# Altium project PROC101D_SCH_With_Design_Updates..Notes_V1.0.PrjPcb (part 8 of 23)

## Sheet 20.SchDoc
size 513 x 386 mm
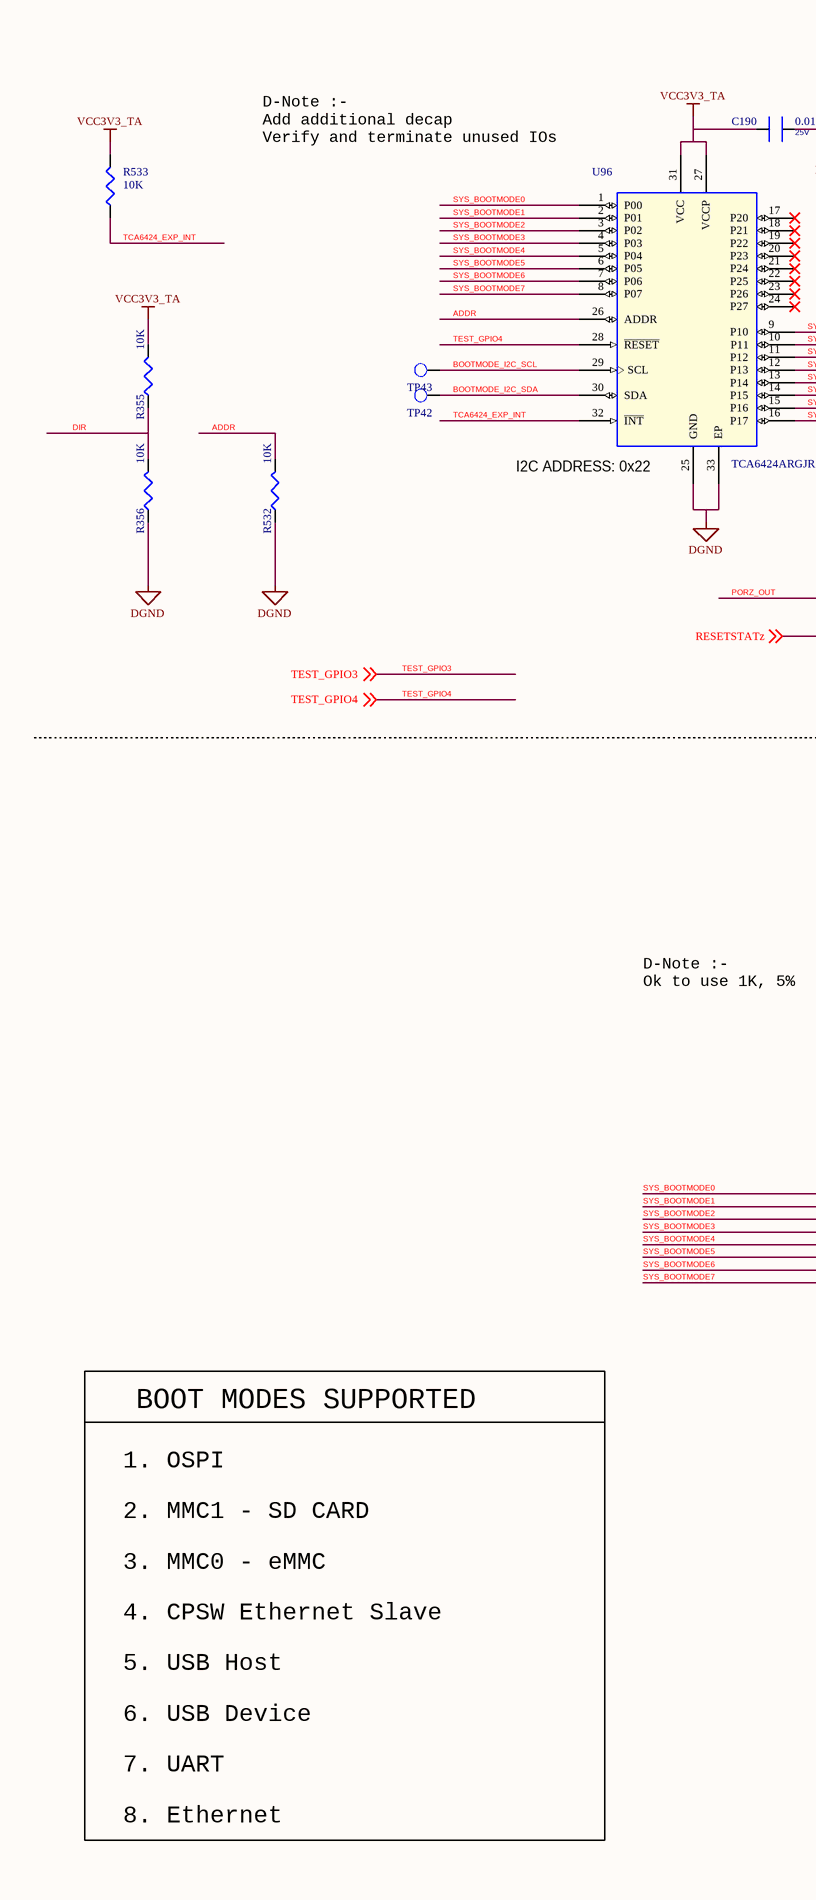
[diagram p30: 20.SchDoc, left]
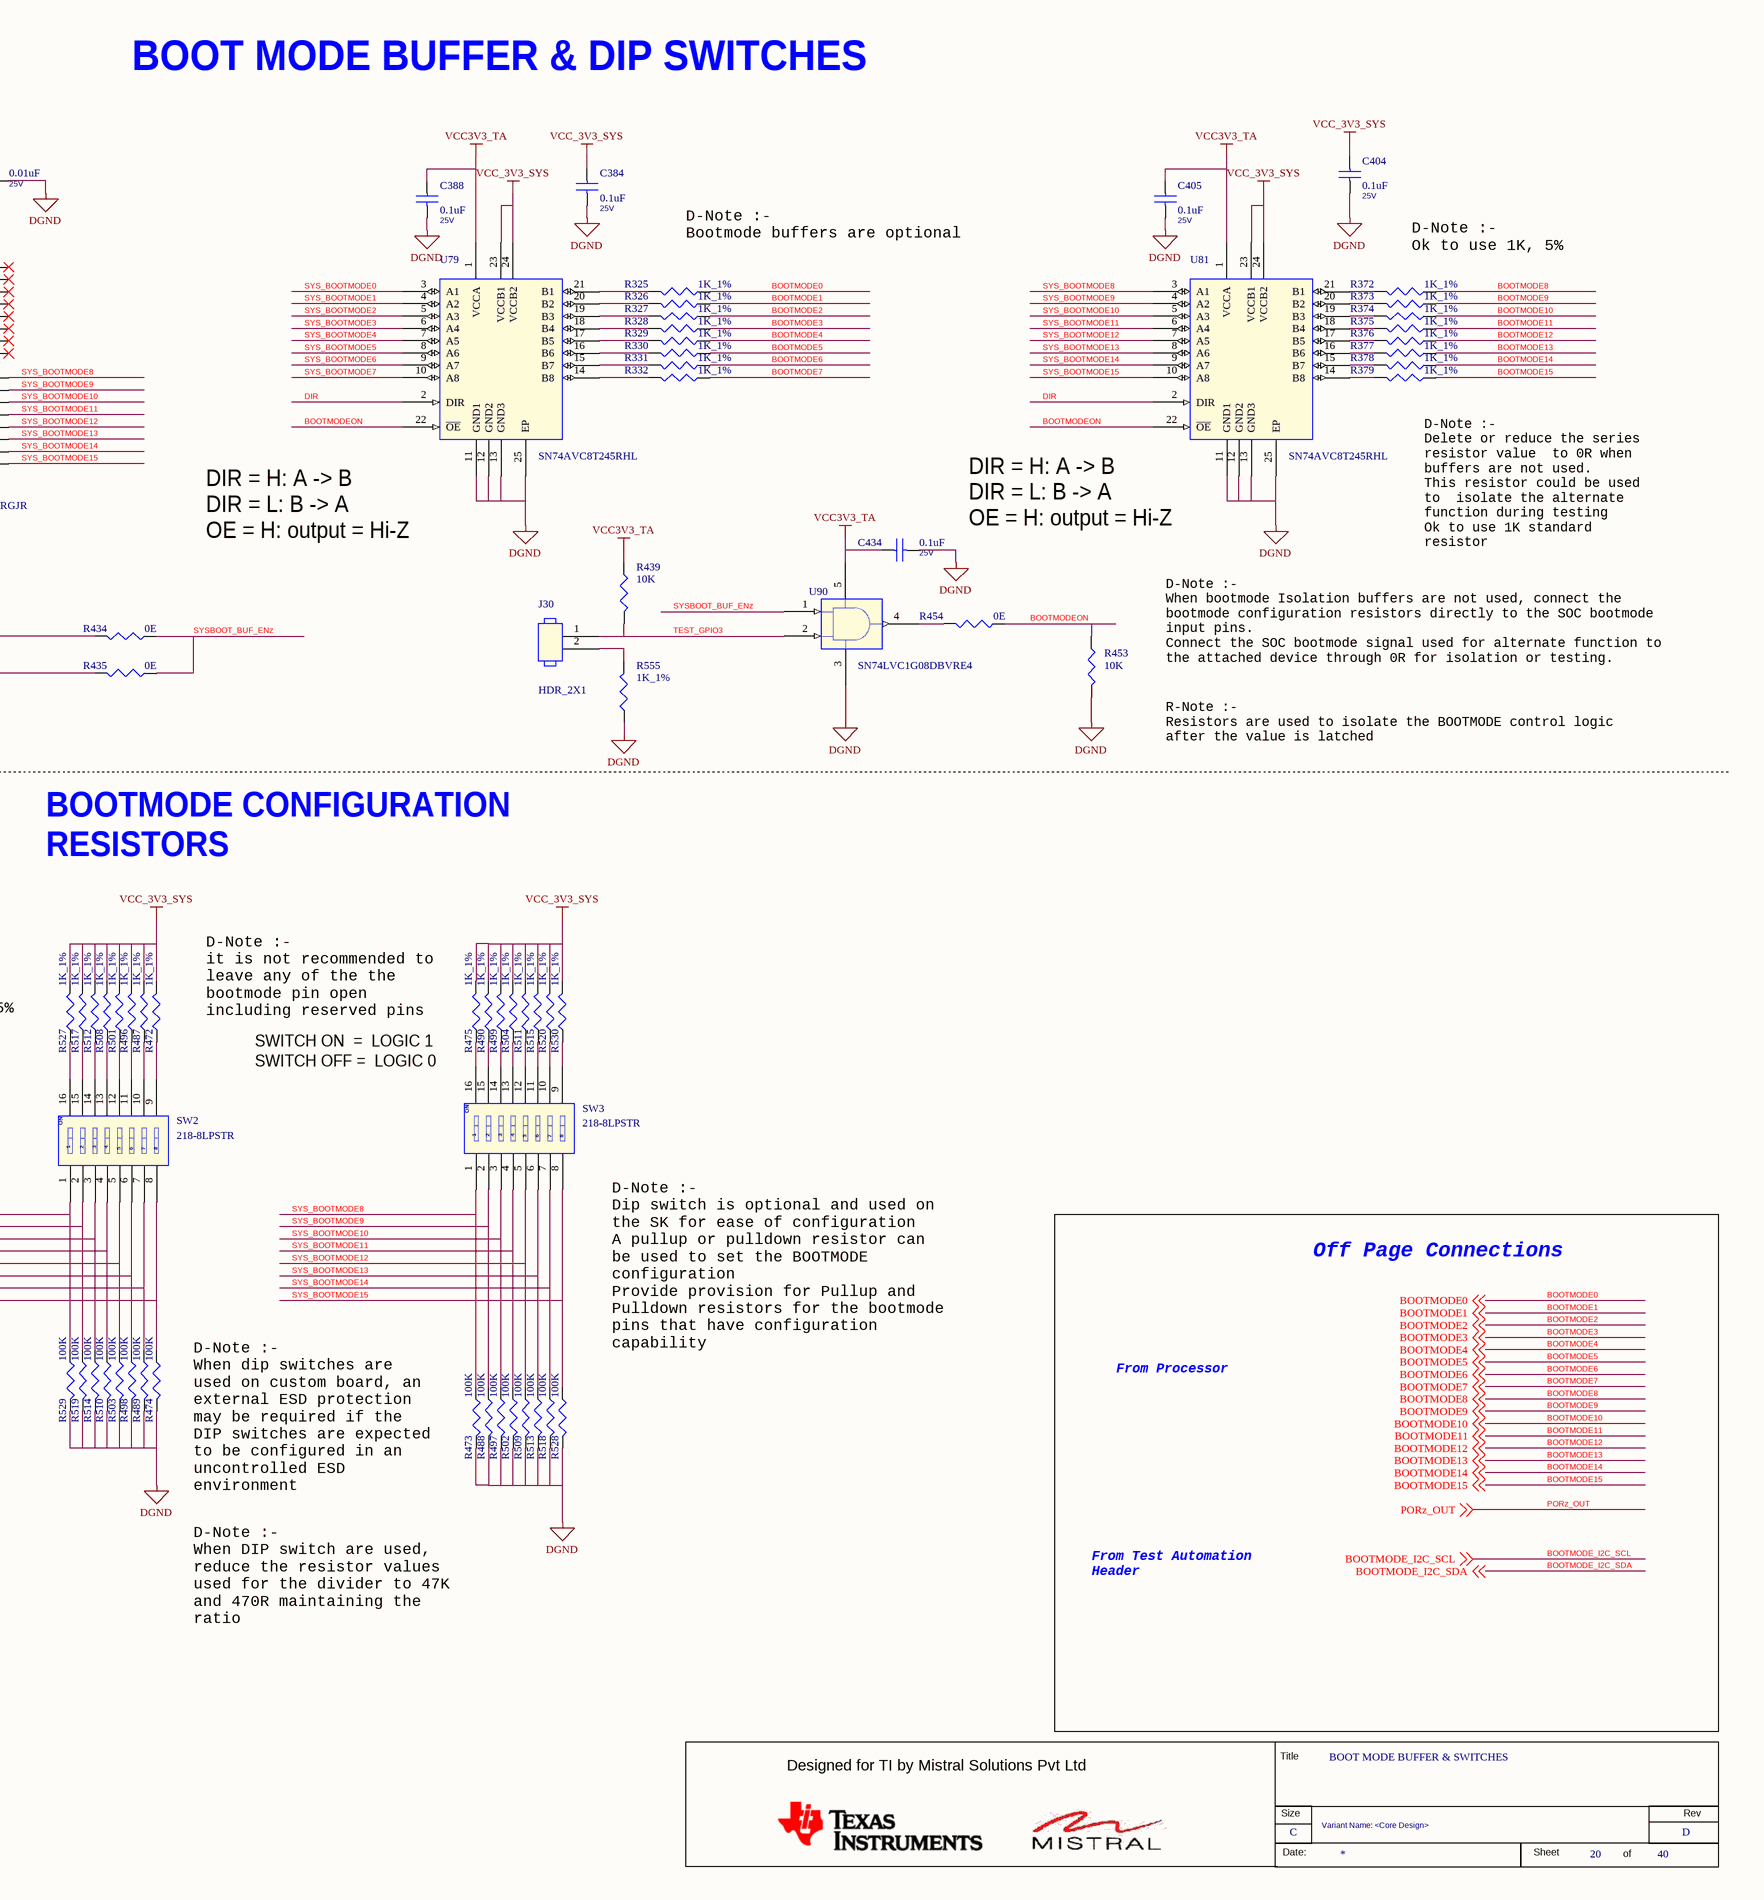
[diagram p31: 20.SchDoc, right]

### Parts
(Parts that share a designator on the sheet are numbered #1, #2 ... from top to bottom, then left to right.)
*#20  RevCode: D  Title: BOOT MODE BUFFER & SWITCHES  Page Size: C  Page Number: 20  Page Count: 40  Variant Name: <Core Design>  (hidden comment: MISTRAL_TITLEBLK_CSIZE)  (graphical)
C190  0.01uF  Voltage: 25V  [CAP0402N]
C384  0.1uF  Voltage: 25V  [CAP0402_0-75]
C388  0.1uF  Voltage: 25V  [CAP0402_0-75]
C404  0.1uF  Voltage: 25V  [CAP0402_0-75]
C405  0.1uF  Voltage: 25V  [CAP0402_0-75]
C434  0.1uF  Voltage: 25V  [CAP0402_0-75]
J30  HDR_2X1  [HDR_2X1_100_S_T_10-8]
R325  1K_1%  [RES0402_0-5]
R326  1K_1%  [RES0402_0-5]
R327  1K_1%  [RES0402_0-5]
R328  1K_1%  [RES0402_0-5]
R329  1K_1%  [RES0402_0-5]
R330  1K_1%  [RES0402_0-5]
R331  1K_1%  [RES0402_0-5]
R332  1K_1%  [RES0402_0-5]
R355  10K  [RES0402_0-5]
R356  10K  [RES0402_0-5]
R372  1K_1%  [RES0402_0-5]
R373  1K_1%  [RES0402_0-5]
R374  1K_1%  [RES0402_0-5]
R375  1K_1%  [RES0402_0-5]
R376  1K_1%  [RES0402_0-5]
R377  1K_1%  [RES0402_0-5]
R378  1K_1%  [RES0402_0-5]
R379  1K_1%  [RES0402_0-5]
R434  0E  [RES0402_0-5]
R435  0E  [RES0402_0-5]
R439  10K  [RES0402_0-5]
R453  10K  [RES0402_0-5]
R454  0E  [RES0402_0-5]
R472  1K_1%  [RES0402_0-5]
R473  100K  [RES0402_0-5]
R474  100K  [RES0402_0-5]
R475  1K_1%  [RES0402_0-5]
R487  1K_1%  [RES0402_0-5]
R488  100K  [RES0402_0-5]
R489  100K  [RES0402_0-5]
R490  1K_1%  [RES0402_0-5]
R496  1K_1%  [RES0402_0-5]
R497  100K  [RES0402_0-5]
R498  100K  [RES0402_0-5]
R499  1K_1%  [RES0402_0-5]
R501  1K_1%  [RES0402_0-5]
R502  100K  [RES0402_0-5]
R503  100K  [RES0402_0-5]
R504  1K_1%  [RES0402_0-5]
R508  1K_1%  [RES0402_0-5]
R509  100K  [RES0402_0-5]
R510  100K  [RES0402_0-5]
R511  1K_1%  [RES0402_0-5]
R512  1K_1%  [RES0402_0-5]
R513  100K  [RES0402_0-5]
R514  100K  [RES0402_0-5]
R515  1K_1%  [RES0402_0-5]
R517  1K_1%  [RES0402_0-5]
R518  100K  [RES0402_0-5]
R519  100K  [RES0402_0-5]
R520  1K_1%  [RES0402_0-5]
R527  1K_1%  [RES0402_0-5]
R528  100K  [RES0402_0-5]
R529  100K  [RES0402_0-5]
R530  1K_1%  [RES0402_0-5]
R532  10K  [RES0402_0-5]
R533  10K  [RES0402_0-5]
R555  1K_1%  [RES0402_0-5]
SW2  218-8LPSTR  [SW6_1P27_8p75x6p0_GDH]
SW3  218-8LPSTR  [SW6_1P27_8p75x6p0_GDH]
TP42  TP20_SMD  [TP20_SMD]  (value not drawn)
TP43  TP20_SMD  [TP20_SMD]  (value not drawn)
U79  SN74AVC8T245RHL  [QFN24_19-68_220X140_1]
U81  SN74AVC8T245RHL  [QFN24_19-68_220X140_1]
U90  SN74LVC1G08DBVRE4  [SOT23-5]
U96  TCA6424ARGJR  [QFN32_19-68_200X200]

### Nets
DGND: C190.1 C384.2 C388.2 C404.2 C405.2 C434.2 R356.1 R453.2 R473.2 R474.2 R488.2 R489.2 R497.2 R498.2 R502.2 R503.2 R509.2 R510.2 R513.2 R514.2 R518.2 R519.2 R528.2 R529.2 R532.1 R555.1 U79.11(GND1) U79.12(GND2) U79.13(GND3) U79.25(EP) U81.11(GND1) U81.12(GND2) U81.13(GND3) U81.25(EP) U90.3(GND) U96.25(GND) U96.33(EP)
VCC3V3_TA: C190.2 C388.1 C405.1 C434.1 R355.2 R439.1 R533.2 U79.1(VCCA) U81.1(VCCA) U90.5(VCC) U96.27(VCCP) U96.31(VCC)  [project net VOUT_TA]
VCC_3V3_SYS: C384.1 C404.1 R472.2 R475.2 R487.2 R490.2 R496.2 R499.2 R501.2 R504.2 R508.2 R511.2 R512.2 R515.2 R517.2 R520.2 R527.2 R530.2 U79.23(VCCB1) U79.24(VCCB2) U81.23(VCCB1) U81.24(VCCB2)
ADDR: R532.2 U96.26(ADDR)
BOOTMODE0: R325.1 ; off-sheet BOOTMODE0
BOOTMODE1: R326.1 ; off-sheet BOOTMODE1
BOOTMODE2: R327.1 ; off-sheet BOOTMODE2
BOOTMODE3: R328.1 ; off-sheet BOOTMODE3
BOOTMODE4: R329.1 ; off-sheet BOOTMODE4
BOOTMODE5: R330.1 ; off-sheet BOOTMODE5
BOOTMODE6: R331.1 ; off-sheet BOOTMODE6
BOOTMODE7: R332.1 ; off-sheet BOOTMODE7
BOOTMODE8: R372.1 ; off-sheet BOOTMODE8
BOOTMODE9: R373.1 ; off-sheet BOOTMODE9
BOOTMODE10: R374.1 ; off-sheet BOOTMODE10
BOOTMODE11: R375.1 ; off-sheet BOOTMODE11
BOOTMODE12: R376.1 ; off-sheet BOOTMODE12
BOOTMODE13: R377.1 ; off-sheet BOOTMODE13
BOOTMODE14: R378.1 ; off-sheet BOOTMODE14
BOOTMODE15: R379.1 ; off-sheet BOOTMODE15
BOOTMODE_I2C_SCL: TP43.1(TP) U96.29(SCL) ; off-sheet BOOTMODE_I2C_SCL
BOOTMODE_I2C_SDA: TP42.1(TP) U96.30(SDA) ; off-sheet BOOTMODE_I2C_SDA
BOOTMODEON: R453.1 R454.1 U79.22(~{OE}) U81.22(~{OE})
DIR: R355.1 R356.2 U79.2(DIR) U81.2(DIR)
PORz_OUT: R434.2 ; off-sheet PORz_OUT
RESETSTATz: R435.2 ; off-sheet RESETSTATz
SYS_BOOTMODE0: R529.1 SW2.1 U79.3(A1) U96.1(P00)
SYS_BOOTMODE1: R519.1 SW2.2 U79.4(A2) U96.2(P01)
SYS_BOOTMODE2: R514.1 SW2.3 U79.5(A3) U96.3(P02)
SYS_BOOTMODE3: R510.1 SW2.4 U79.6(A4) U96.4(P03)
SYS_BOOTMODE4: R503.1 SW2.5 U79.7(A5) U96.5(P04)
SYS_BOOTMODE5: R498.1 SW2.6 U79.8(A6) U96.6(P05)
SYS_BOOTMODE6: R489.1 SW2.7 U79.9(A7) U96.7(P06)
SYS_BOOTMODE7: R474.1 SW2.8 U79.10(A8) U96.8(P07)
SYS_BOOTMODE8: R473.1 SW3.1 U81.3(A1) U96.9(P10)
SYS_BOOTMODE9: R488.1 SW3.2 U81.4(A2) U96.10(P11)
SYS_BOOTMODE10: R497.1 SW3.3 U81.5(A3) U96.11(P12)
SYS_BOOTMODE11: R502.1 SW3.4 U81.6(A4) U96.12(P13)
SYS_BOOTMODE12: R509.1 SW3.5 U81.7(A5) U96.13(P14)
SYS_BOOTMODE13: R513.1 SW3.6 U81.8(A6) U96.14(P15)
SYS_BOOTMODE14: R518.1 SW3.7 U81.9(A7) U96.15(P16)
SYS_BOOTMODE15: R528.1 SW3.8 U81.10(A8) U96.16(P17)
SYSBOOT_BUF_ENz: R434.1 R435.1 U90.1(A)
TCA6424_EXP_INT: R533.1 U96.32(~{INT})
TEST_GPIO3: J30.1 R439.2 U90.2(B) ; off-sheet TEST_GPIO3
TEST_GPIO4: U96.28(~{RESET}) ; off-sheet TEST_GPIO4
NetJ30_2: J30.2 R555.2
NetR325_2: R325.2 U79.21(B1)
NetR326_2: R326.2 U79.20(B2)
NetR327_2: R327.2 U79.19(B3)
NetR328_2: R328.2 U79.18(B4)
NetR329_2: R329.2 U79.17(B5)
NetR330_2: R330.2 U79.16(B6)
NetR331_2: R331.2 U79.15(B7)
NetR332_2: R332.2 U79.14(B8)
NetR372_2: R372.2 U81.21(B1)
NetR373_2: R373.2 U81.20(B2)
NetR374_2: R374.2 U81.19(B3)
NetR375_2: R375.2 U81.18(B4)
NetR376_2: R376.2 U81.17(B5)
NetR377_2: R377.2 U81.16(B6)
NetR378_2: R378.2 U81.15(B7)
NetR379_2: R379.2 U81.14(B8)
NetR454_2: R454.2 U90.4(Y)
NetR472_1: R472.1 SW2.9
NetR475_1: R475.1 SW3.16
NetR487_1: R487.1 SW2.10
NetR490_1: R490.1 SW3.15
NetR496_1: R496.1 SW2.11
NetR499_1: R499.1 SW3.14
NetR501_1: R501.1 SW2.12
NetR504_1: R504.1 SW3.13
NetR508_1: R508.1 SW2.13
NetR511_1: R511.1 SW3.12
NetR512_1: R512.1 SW2.14
NetR515_1: R515.1 SW3.11
NetR517_1: R517.1 SW2.15
NetR520_1: R520.1 SW3.10
NetR527_1: R527.1 SW2.16
NetR530_1: R530.1 SW3.9

Not connected (* = marked no-connect by the designer): U96 17(P20)* 18(P21)* 19(P22)* 20(P23)* 21(P24)* 22(P25)* 23(P26)* 24(P27)*

### Notes on the sheet
- BOOT MODE BUFFER & DIP SWITCHES
- D-Note :-
  Add additional decap
  Verify and terminate unused IOs
- D-Note :-
  Bootmode buffers are optional
- D-Note :-
  Ok to use 1K, 5%
- D-Note :-
  Delete or reduce the series
  resistor value  to 0R when
  buffers are not used.
  This resistor could be used
  to  isolate the alternate
  function during testing
  Ok to use 1K standard
  resistor
- (near U79) DIR = H: A -> B
  DIR = L: B -> A
  OE = H: output = Hi-Z
- (near U81) DIR = H: A -> B
  DIR = L: B -> A
  OE = H: output = Hi-Z
- (near U96) I2C ADDRESS: 0x22
- D-Note :-
  When bootmode Isolation buffers are not used, connect the
  bootmode configuration resistors directly to the SOC bootmode
  input pins.
  Connect the SOC bootmode signal used for alternate function to
  the attached device through 0R for isolation or testing.
- R-Note :-
  Resistors are used to isolate the BOOTMODE control logic
  after the value is latched
- BOOTMODE CONFIGURATION RESISTORS
  AND BOOTMODE SWITCHES
- D-Note :-
  it is not recommended to
  leave any of the the
  bootmode pin open
  including reserved pins
- SWITCH ON  =  LOGIC 1
  SWITCH OFF =  LOGIC 0
- D-Note :-
  Dip switch is optional and used on
  the SK for ease of configuration
  A pullup or pulldown resistor can
  be used to set the BOOTMODE
  configuration
  Provide provision for Pullup and
  Pulldown resistors for the bootmode
  pins that have configuration
  capability
- Off Page Connections
- D-Note :-
  When dip switches are
  used on custom board, an
  external ESD protection
  may be required if the
  DIP switches are expected
  to be configured in an
  uncontrolled ESD
  environment
- From Processor
- BOOT MODES SUPPORTED
- 1. OSPI
- 2. MMC1 - SD CARD
- D-Note :-
  When DIP switch are used,
  reduce the resistor values
  used for the divider to 47K
  and 470R maintaining the
  ratio
- 3. MMC0 - eMMC
- From Test Automation
  Header
- 4. CPSW Ethernet Slave
- 5. USB Host
- 6. USB Device
- 7. UART
- 8. Ethernet
- (in symbol MISTRAL_TITLEBLK_CSIZE) Title; Designed for TI by Mistral Solutions Pvt Ltd; Size; Rev; Date:; Sheet; of
- (in symbol SW8_218-8LPSTR) ON

### Library data of the parts
*#20 = MISTRAL_TITLEBLK_CSIZE: Issue: 1.0; Page Create Date: March  8, 1995; Page Modify Date: *
C190 = CAP_Dup2: CAP CERAMIC 0.01uF 25V 10% X7R 0402; Part_type: CAPACITORS\CERAMIC; Mfr_part_number: 885012205050; Mfr_name: WURTH ELECTRONICS; Mistral Part No: 120011090040-R; MECHANICAL 3D STEP FILE: CAP0402_0-75; Wattage: NA; Custom_Duty: 15%; Customs_HS_Code: 85322990; Project: AM64x_EVM_BRD; Footprint Path: Y:\MIS_DATABASE\Library\ALTIUM_TOOL\PCB_FOOTPRINTS\Altium_Footprint_Lib.PcbLib; Library Path: Y:\MIS_DATABASE\Library\ALTIUM_TOOL\SCHEMATICS_PARTS\MS_DISCRETE_Library.schlib; Footprint Ref: CAP0402_0-75; Temperature: -55癈+125癈; Weight: 0.65mg; Chkd/date: MANIRAJA/170820; Crtd /date: ALVY/170820; Datasheet: Y:\MIS_DATABASE\DATASHEETS\CAPACITORS\885012205050.PDF; Height: 0.55MM; Distributor_part_number: 732-7545-1-ND; Distributor_name: DIGIKEY; Package: 0402; Tolerance: 10%; Library Ref: CAP; PCB Footprint: CAP0402_0-75
C384 C388 = CAP_Dup3: as C67 on sheet 18; Footprint Path: Y:\MIS_DATABASE\Library\ALTIUM_TOOL\PCB_FOOTPRINTS\Altium_Footprint_Lib.PcbLib; Library Path: Y:\MIS_DATABASE\Library\ALTIUM_TOOL\SCHEMATICS_PARTS\MS_DISCRETE_Library.schlib; Footprint Ref: CAP0402_0-75; Library Ref: CAP; MECHANICAL 3D STEP FILE: CAP0402_0-75; Chkd/date: MANIRAJA/170820; Crtd /date: ALVY/170820; Datasheet: Y:\MIS_DATABASE\DATASHEETS\CAPACITORS\885012105018.PDF; Temperature: -55癈+85癈; Weight: 0.65mg; Height: 0.55MM; Distributor_part_number: 732-7495-1-ND; Distributor_name: DIGIKEY; Package: 0402; Tolerance: 20%; PCB Footprint: CAP0402_0-75
C404 C405 C434 = CAP_Dup3: as C89 on sheet 17; Tolerance: 20%; Package: 0402; Distributor_name: DIGIKEY; Distributor_part_number: 732-7495-1-ND; Height: 0.55MM; Weight: 0.65mg; Temperature: -55癈+85癈; Datasheet: Y:\MIS_DATABASE\DATASHEETS\CAPACITORS\885012105018.PDF; Crtd /date: ALVY/170820; Chkd/date: MANIRAJA/170820; MECHANICAL 3D STEP FILE: CAP0402_0-75; Library Ref: CAP; Footprint Ref: CAP0402_0-75; Library Path: Y:\MIS_DATABASE\Library\ALTIUM_TOOL\SCHEMATICS_PARTS\MS_DISCRETE_Library.schlib; Footprint Path: Y:\MIS_DATABASE\Library\ALTIUM_TOOL\PCB_FOOTPRINTS\Altium_Footprint_Lib.PcbLib; PCB Footprint: CAP0402_0-75
J30 = HEADER_2X1_Dup1: CON HDR 2X1 2.54MM PITCH ST TH; Mistral Part No: 150009030246-R; Mfr_name: MOLEX; Part_type: CONNECTOR\HEADERS; Wattage: NA; Project: FPGA EXTENDER CARD; Customs_HS_Code: 85369090; Custom_Duty: 24%; Footprint Ref: HDR_2X1_100_S_T_10-8; Library Ref: HEADER_2X1; Footprint Path: Y:\MIS_DATABASE\Library\ALTIUM_TOOL\PCB_FOOTPRINTS\Altium_Footprint_Lib.PcbLib; Library Path: Y:\MIS_DATABASE\Library\ALTIUM_TOOL\SCHEMATICS_PARTS\MS_Connector_Library.schlib; MECHANICAL 3D STEP FILE: HDR_2X1_100_S_T_10-8; Temperature: -0癈+75癈; Weight: 139gm; Voltage: NA; Tolerance: NA; Mfr_part_number: 22-03-2021; Package: THRU-HOLE; Distributor_name: DIGIKEY; Distributor_part_number: WM4000-ND; Height: 10.79MM; Datasheet: Y:\MIS_DATABASE\DATASHEETS\CONNECTORS\HEADER_X4030.PDF; Crtd /date: MAZHAR/280405; Chkd/date: VASANTHA/060117; PCB Footprint: HDR_2X1_100_S_T_10-8
R325-R332 R472 R475 R487 R490 R496 R499 R501 R504 R508 R511 R512 R515 R517 R520 R527 R530 R555 = RESISTOR_Dup5: RES 1K 1/10W 1% 0402; Part_type: RESISTORS\FIXED; Mfr_part_number: ERJ-2RKF1001X; Mfr_name: PANASONIC-ECG; Mistral Part No: 110009030411-R; Custom_Duty: 15%; Customs_HS_Code: 85332119; Voltage: NA; Project: VOCERA; PCB Footprint: RES0402_0-5; Chkd/date: VASANTHA/281216; Crtd /date: MAZHAR/150506; Datasheet: Y:\MIS_DATABASE\DATASHEETS\RESISTORS\PAN-ERJSER_NOV17.PDF; Temperature: -55癈+155癈; Weight: 0.8mg; Height: 0.40MM; Distributor_part_number: P1.00KLCT-ND; Distributor_name: DIGIKEY; Package: 0402; Wattage: 1/10W; Tolerance: 1%; Library Ref: RESISTOR; Footprint Ref: RES0402_0-5; MECHANICAL 3D STEP FILE: RES0402_0-5; Library Path: Y:\MIS_DATABASE\Library\ALTIUM_TOOL\SCHEMATICS_PARTS\MS_DISCRETE_Library.schlib; Footprint Path: Y:\MIS_DATABASE\Library\ALTIUM_TOOL\PCB_FOOTPRINTS\Altium_Footprint_Lib.PcbLib
R355 R356 R453 = RESISTOR_Dup6: as R120 on sheet 17; PCB Footprint: RES0402_0-5; Footprint Path: Y:\MIS_DATABASE\Library\ALTIUM_TOOL\PCB_FOOTPRINTS\Altium_Footprint_Lib.PcbLib; Library Path: Y:\MIS_DATABASE\Library\ALTIUM_TOOL\SCHEMATICS_PARTS\MS_DISCRETE_Library.schlib; Footprint Ref: RES0402_0-5; Library Ref: RESISTOR; Tolerance: 5%; Wattage: 1/16W; Package: 0402; Distributor_name: DIGIKEY; Distributor_part_number: 311-10KJRCT-ND; Height: 0.40MM; Weight: 0.65mg; Temperature: -55癈+155癈; Datasheet: Y:\MIS_DATABASE\DATASHEETS\RESISTORS\RCXXXXL-SER_MAR18.PDF; Crtd /date: MAZHAR/230805; Chkd/date: VASANTHA/061216; MECHANICAL 3D STEP FILE: RES0402_0-5
R372-R379 = RESISTOR_Dup5: RES 1K 1/10W 1% 0402; Mistral Part No: 110009030411-R; Mfr_name: PANASONIC-ECG; Mfr_part_number: ERJ-2RKF1001X; Part_type: RESISTORS\FIXED; Project: VOCERA; Voltage: NA; Customs_HS_Code: 85332119; Custom_Duty: 15%; PCB Footprint: RES0402_0-5; Footprint Path: Y:\MIS_DATABASE\Library\ALTIUM_TOOL\PCB_FOOTPRINTS\Altium_Footprint_Lib.PcbLib; Library Path: Y:\MIS_DATABASE\Library\ALTIUM_TOOL\SCHEMATICS_PARTS\MS_DISCRETE_Library.schlib; MECHANICAL 3D STEP FILE: RES0402_0-5; Footprint Ref: RES0402_0-5; Library Ref: RESISTOR; Tolerance: 1%; Wattage: 1/10W; Package: 0402; Distributor_name: DIGIKEY; Distributor_part_number: P1.00KLCT-ND; Height: 0.40MM; Weight: 0.8mg; Temperature: -55癈+155癈; Datasheet: Y:\MIS_DATABASE\DATASHEETS\RESISTORS\PAN-ERJSER_NOV17.PDF; Crtd /date: MAZHAR/150506; Chkd/date: VASANTHA/281216
R434 R435 R454 = RESISTOR_Dup5: as R99 on sheet 18; Footprint Path: Y:\MIS_DATABASE\Library\ALTIUM_TOOL\PCB_FOOTPRINTS\Altium_Footprint_Lib.PcbLib; Library Path: Y:\MIS_DATABASE\Library\ALTIUM_TOOL\SCHEMATICS_PARTS\MS_DISCRETE_Library.schlib; Footprint Ref: RES0402_0-5; Library Ref: RESISTOR; Voltage: NA; Wattage: 1/16W; Package: 0402; Distributor_name: DIGIKEY; Distributor_part_number: 541-0.0JCT-ND; Height: 0.40MM; Weight: 0.65mg; Temperature: -55癈+155癈; Datasheet: Y:\MIS_DATABASE\DATASHEETS\RESISTORS\CRCW0603.PDF; Crtd /date: MUDDU/190810; Chkd/date: VASANTHA/201216; MECHANICAL 3D STEP FILE: RES0402_0-5; PCB Footprint: RES0402_0-5
R439 R532 R533 = RESISTOR_Dup6: as R121 on sheet 17; Footprint Path: Y:\MIS_DATABASE\Library\ALTIUM_TOOL\PCB_FOOTPRINTS\Altium_Footprint_Lib.PcbLib; Library Path: Y:\MIS_DATABASE\Library\ALTIUM_TOOL\SCHEMATICS_PARTS\MS_DISCRETE_Library.schlib; Footprint Ref: RES0402_0-5; Library Ref: RESISTOR; MECHANICAL 3D STEP FILE: RES0402_0-5; Chkd/date: VASANTHA/061216; Crtd /date: MAZHAR/230805; Datasheet: Y:\MIS_DATABASE\DATASHEETS\RESISTORS\RCXXXXL-SER_MAR18.PDF; Temperature: -55癈+155癈; Weight: 0.65mg; Height: 0.40MM; Distributor_part_number: 311-10KJRCT-ND; Distributor_name: DIGIKEY; Package: 0402; Wattage: 1/16W; Tolerance: 5%; PCB Footprint: RES0402_0-5
R473 R489 R497 R503 R509 R510 R519 R528 = RESISTOR_Dup5: RES 100K 1/16W 5% 0402; Part_type: RESISTORS\FIXED; Mfr_part_number: CRCW0402100KJNED; Mfr_name: VISHAY; Mistral Part No: 110011060002-R; Custom_Duty: 15%; Customs_HS_Code: 85332119; Voltage: NA; Project: AM4515_EVM_LCD; PCB Footprint: RES0402_0-5; Footprint Path: Y:\MIS_DATABASE\Library\ALTIUM_TOOL\PCB_FOOTPRINTS\Altium_Footprint_Lib.PcbLib; Library Path: Y:\MIS_DATABASE\Library\ALTIUM_TOOL\SCHEMATICS_PARTS\MS_DISCRETE_Library.schlib; Footprint Ref: RES0402_0-5; Library Ref: RESISTOR; MECHANICAL 3D STEP FILE: RES0402_0-5; Chkd/date: VASANTHA/061216; Crtd /date: BAVISH/010611; Datasheet: Y:\MIS_DATABASE\DATASHEETS\RESISTORS\CRCW0603.PDF; Temperature: -55癈+155癈; Weight: 0.65mg; Height: 0.40MM; Distributor_part_number: 541-100KJCT-ND; Distributor_name: DIGIKEY; Package: 0402; Wattage: 1/16W; Tolerance: 5%
R474 R488 R498 R502 R513 R514 R518 R529 = RESISTOR_Dup5: RES 100K 1/16W 5% 0402; Mistral Part No: 110011060002-R; Mfr_name: VISHAY; Mfr_part_number: CRCW0402100KJNED; Part_type: RESISTORS\FIXED; Project: AM4515_EVM_LCD; Voltage: NA; Customs_HS_Code: 85332119; Custom_Duty: 15%; PCB Footprint: RES0402_0-5; Footprint Path: Y:\MIS_DATABASE\Library\ALTIUM_TOOL\PCB_FOOTPRINTS\Altium_Footprint_Lib.PcbLib; Library Path: Y:\MIS_DATABASE\Library\ALTIUM_TOOL\SCHEMATICS_PARTS\MS_DISCRETE_Library.schlib; Footprint Ref: RES0402_0-5; Library Ref: RESISTOR; MECHANICAL 3D STEP FILE: RES0402_0-5; Tolerance: 5%; Wattage: 1/16W; Package: 0402; Distributor_name: DIGIKEY; Distributor_part_number: 541-100KJCT-ND; Height: 0.40MM; Weight: 0.65mg; Temperature: -55癈+155癈; Datasheet: Y:\MIS_DATABASE\DATASHEETS\RESISTORS\CRCW0603.PDF; Crtd /date: BAVISH/010611; Chkd/date: VASANTHA/061216
SW2 SW3 = SW8_218-8LPSTR: SWITCH DIP SPST HALF PITCH 8POS SMD; Part No (Manufacturer): GDH06S04 (Tyco Electronics); Mistral Part No: 130017080019-R; Mfr_name: CTS; Part_type: ELECTRO-MECHANICAL\SWITCH; Compliance: RoHS; Component Name: DIP Sw_GDH06S04; PCB Footprint: SW8_218-8LPST_450X230_SMD_2-7; Project: TI_RF_DC CARD; Tolerance: NA; Customs_HS_Code: 85369090; Custom_Duty: 24%; Operating Temp Range: -30 to 85C; Type: DIP; Mfr_part_number: 218-8LPSTR; Voltage: NA; Wattage: NA; Package: SMD; Distributor_name: DIGIKEY; Distributor_part_number: CT3112CT-ND; Library Ref: SW8_218-8LPSTR; Height: 2.65MM; Weight: NA; Temperature: -55癈+85癈; Datasheet: Y:\MIS_DATABASE\DATASHEETS\MISC\SWITCHES\128-12LPST.PDF; Crtd /date: MANIRAJA/230817; Chkd/date: MANIRAJA/230817; MECHANICAL 3D STEP FILE: SW8_218-8LPST_450X230_SMD_2-7
TP42 TP43 = TESTPOINT: TESTPOINT CIR 20 SMD; Mfr_name: LOCAL; Mistral Part No: NA; Project: BT MODULE_CSRBC04; PCB Footprint: TP20_SMD; RoHS: NA; Footprint Ref: TP20_SMD; Library Ref: TESTPOINT; Chkd/date: SHREESHAIL/171006; Crtd /date: MAZHAR/171006; Height: NA; Distributor_part_number: NA; Distributor_name: NA; Package: SMD; Part_type: TESTPOINT; Mfr_part_number: TP20_SMD; Tolerance: NA; Voltage: NA; Wattage: NA; Weight: NA; Temperature: NA; Datasheet: NA; MECHANICAL 3D STEP FILE: NA; Library Path: Y:\MIS_DATABASE\Library\ALTIUM_TOOL\SCHEMATICS_PARTS\MS_DISCRETE_Library.schlib; Footprint Path: Y:\MIS_DATABASE\Library\ALTIUM_TOOL\PCB_FOOTPRINTS\Altium_Footprint_Lib.PcbLib; Customs_HS_Code: NA; Custom_Duty: NA
U79 U81 = SN74AVC8T245RHL_QFN24: IC BUS TRANSCEIVER 8-BIT DUAL-SUPPLY QFN24; Part_type: ICS\TELECOM\TRANSCEIVER; Mfr_part_number: SN74AVC8T245RHLR; Mfr_name: TEXAS INSTRUMENTS; Mistral Part No: 143011040001-R; Custom_Duty: 15%; Customs_HS_Code: 85423100; Wattage: NA; Project: OMAPL1_PEC20; PCB Footprint: QFN24_19-68_220X140_1; MECHANICAL 3D STEP FILE: QFN24_19-68_220X140_1; Chkd/date: VASANTHA/231216; Crtd /date: BAVISH/290411; Datasheet: Y:\MIS_DATABASE\DATASHEETS\ICS\DIGITAL\BUSTRANSCEIVER\SN74AVC8T245.PDF; Temperature: -40癈+85癈; Weight: NA; Height: 1.00MM; Distributor_part_number: 296-17859-1-ND; Distributor_name: DIGIKEY; Package: QFN24; Voltage: NA; Tolerance: NA; Library Ref: SN74AVC8T245RHL_QFN24
U90 = SN74LVC1G08DBVRE4_SOT23-5: as U31 on sheet 17; RoHS: Sb/ Br FREE; Chkd/date: SUHAS/221010; Crtd /date: USMAN/151008; Datasheet: Y:\MIS_DATABASE\DATASHEETS\ICS\DIGITAL\GATES\SN74LVC1G08.PDF; Temperature: -40癈+85癈; Height: 1.45MM; Library Ref: SN74LVC1G08DBVRE4_SOT23-5; Distributor_part_number: SN74LVC1G08DBVRE4-ND; Distributor_name: DIGIKEY; Package: SOT23-5; Mfr_part_number: SN74LVC1G08DBVRE4; PCB Footprint: SOT23-5
U96 = TCA6424ARGJR_QFN32: IC I2C I/O EXPANDER 24B UQFN32; Mistral Part No: 141014090009-R; Mfr_name: TEXAS INSTRUMENTS; Part_type: ICS\DIGITAL\BUSTRANSCEIVER; Project: ZK_BIOMETRIC; Customs_HS_Code: 85423100; Custom_Duty: 15%; PCB Footprint: QFN32_19-68_200X200; Mfr_part_number: TCA6424ARGJR; Package: UQFN32; Distributor_name: DIGIKEY; Distributor_part_number: 296-27844-1-ND; Height: 0.60MM; Weight: NA; Temperature: -40癈+85癈; Datasheet: Y:\MIS_DATABASE\DATASHEETS\ICS\DIGITAL\BUSTRANSCEIVER\TCA6424AR.PDF; Crtd /date: NAVEED/100914; Chkd/date: NAVEED/100715; Library Ref: TCA6424ARGJR_QFN32

## Sheet 21.SchDoc
size 513 x 386 mm
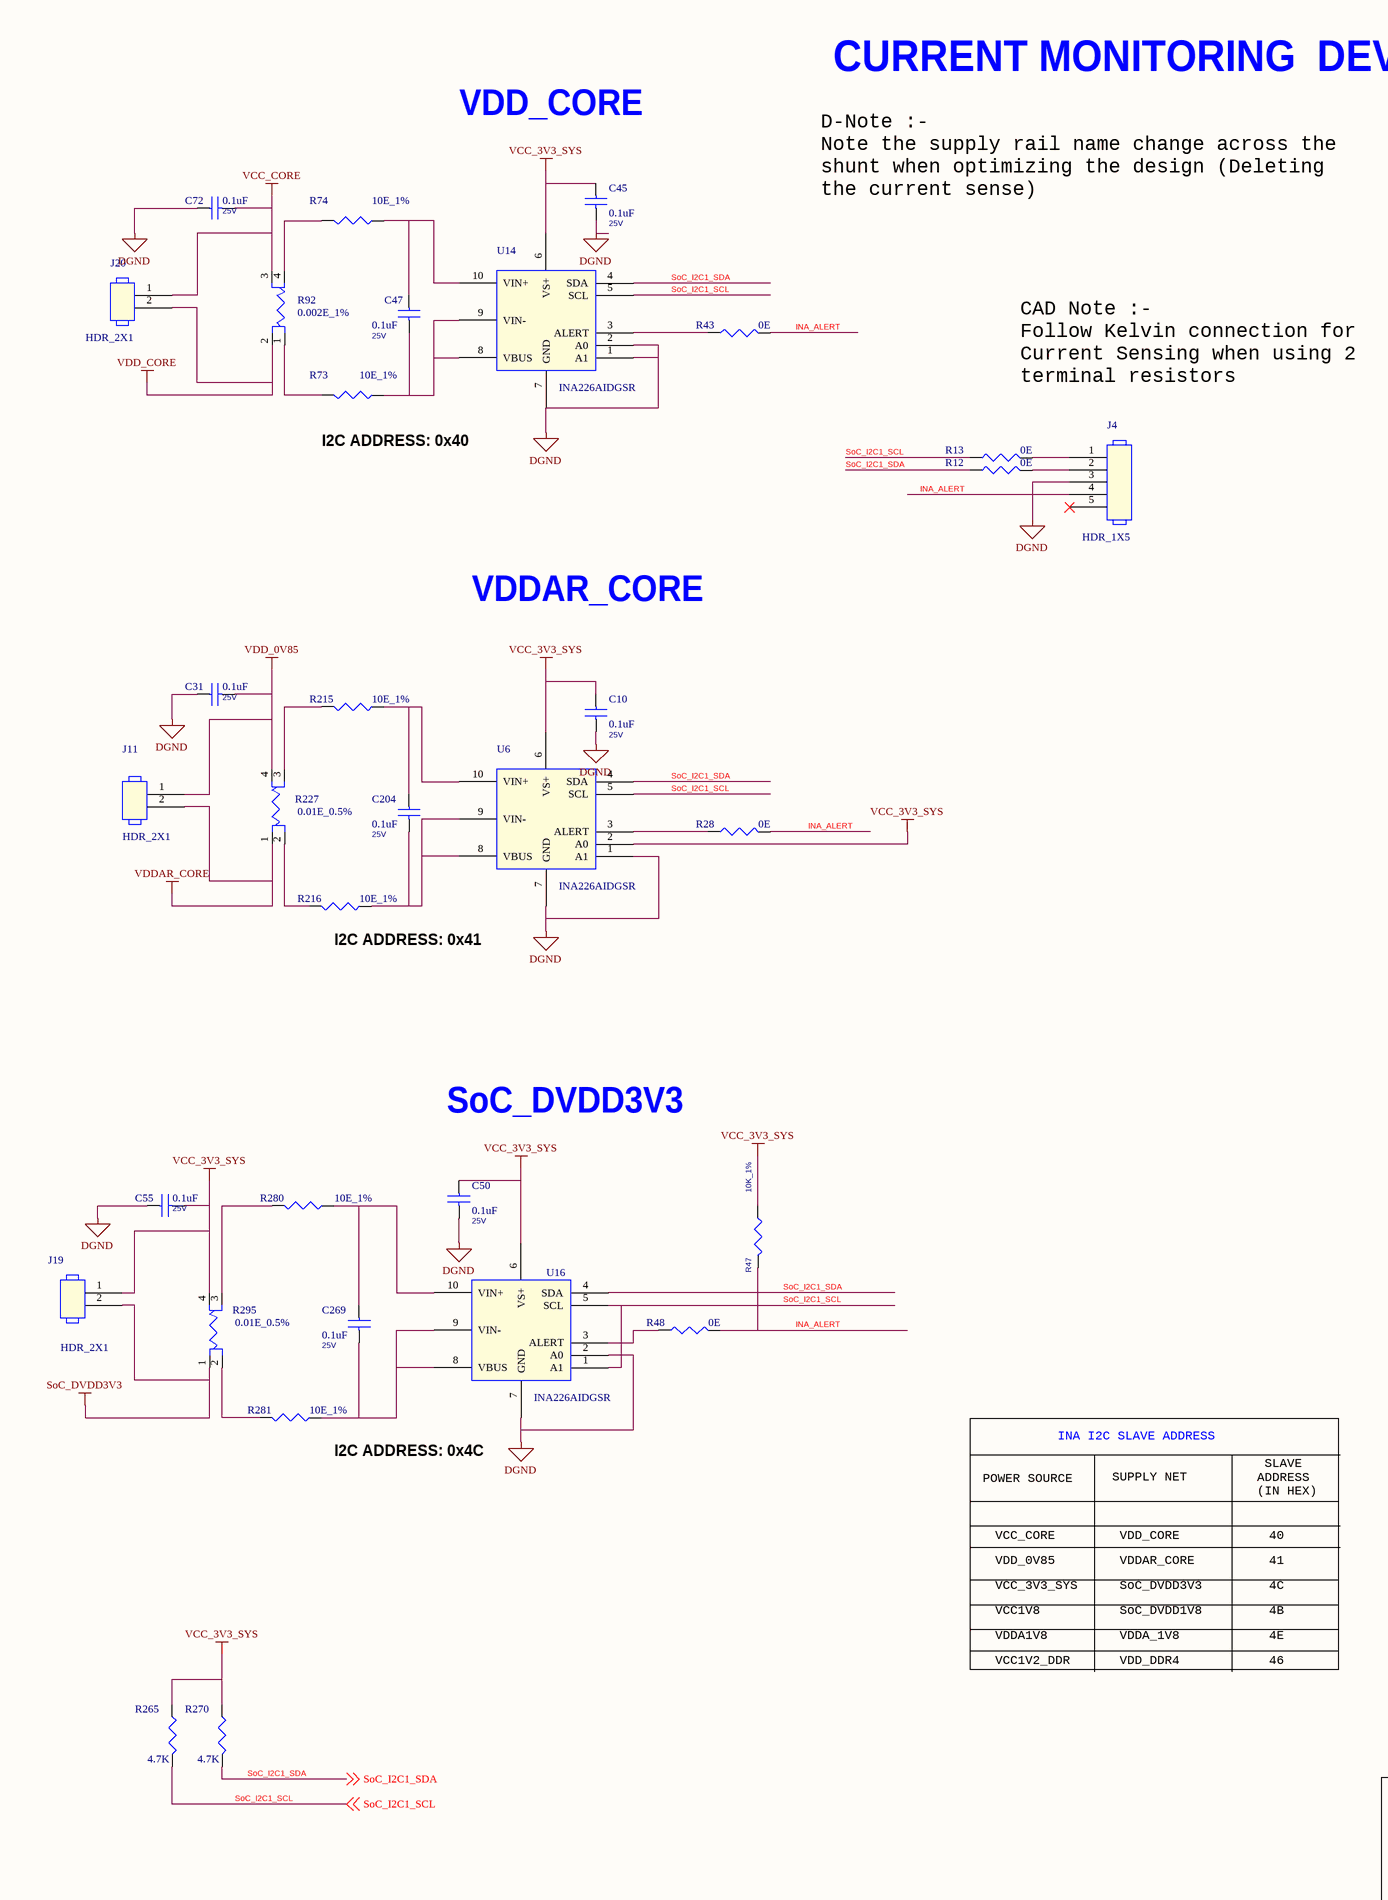
[diagram p32: 21.SchDoc, left]
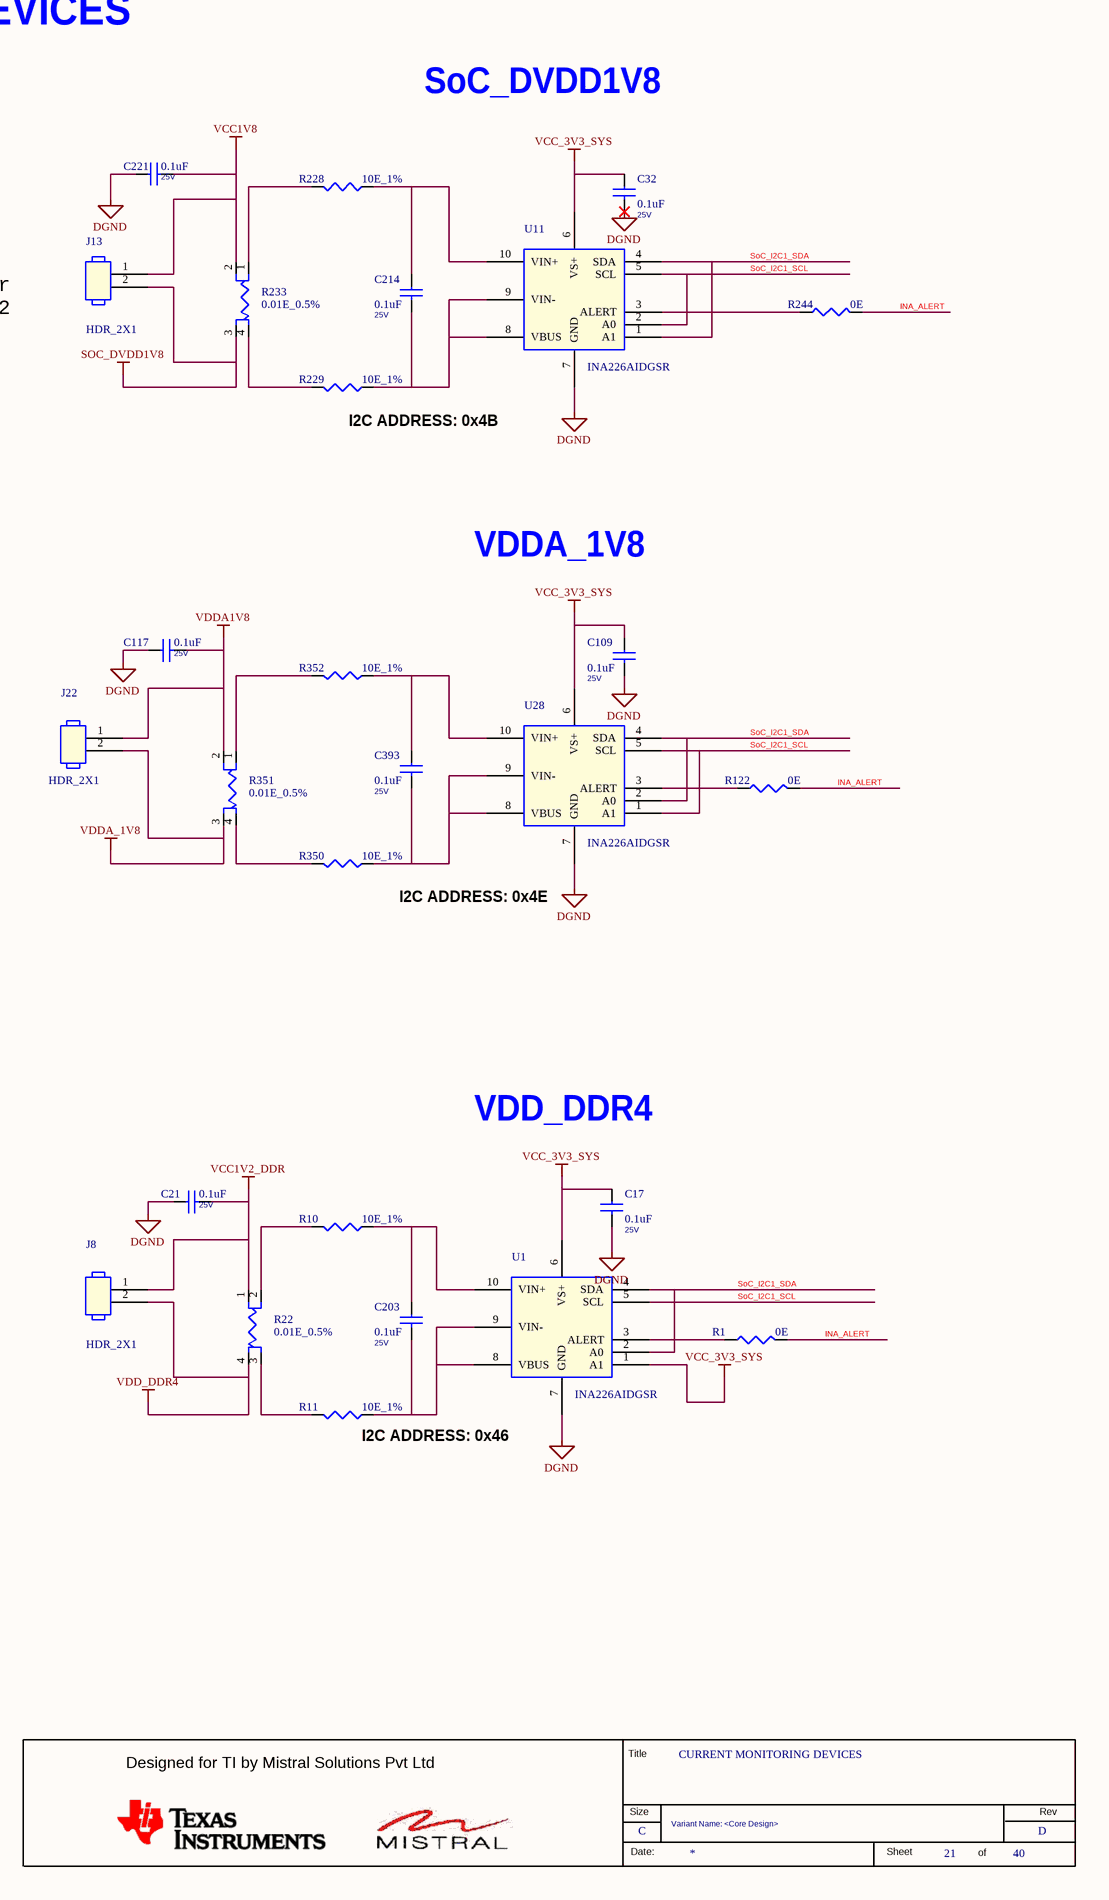
[diagram p33: 21.SchDoc, right]

### Parts
(Parts that share a designator on the sheet are numbered #1, #2 ... from top to bottom, then left to right.)
*#21  RevCode: D  Title: CURRENT MONITORING DEVICES  Page Size: C  Page Number: 21  Page Count: 40  Variant Name: <Core Design>  (hidden comment: MISTRAL_TITLEBLK_CSIZE)  (graphical)
C10  0.1uF  Voltage: 25V  [CAP0402_0-75]
C17  0.1uF  Voltage: 25V  [CAP0402_0-75]
C21  0.1uF  Voltage: 25V  [CAP0402_0-75]
C31  0.1uF  Voltage: 25V  [CAP0402_0-75]
C32  0.1uF  Voltage: 25V  [CAP0402_0-75]
C45  0.1uF  Voltage: 25V  [CAP0402_0-75]
C47  0.1uF  Voltage: 25V  [CAP0402_0-75]
C50  0.1uF  Voltage: 25V  [CAP0402_0-75]
C55  0.1uF  Voltage: 25V  [CAP0402_0-75]
C72  0.1uF  Voltage: 25V  [CAP0402_0-75]
C109  0.1uF  Voltage: 25V  [CAP0402_0-75]
C117  0.1uF  Voltage: 25V  [CAP0402_0-75]
C203  0.1uF  Voltage: 25V  [CAP0402_0-75]
C204  0.1uF  Voltage: 25V  [CAP0402_0-75]
C214  0.1uF  Voltage: 25V  [CAP0402_0-75]
C221  0.1uF  Voltage: 25V  [CAP0402_0-75]
C269  0.1uF  Voltage: 25V  [CAP0402_0-75]
C393  0.1uF  Voltage: 25V  [CAP0402_0-75]
J4  HDR_1X5  [HDR_5X1_100_S_T_11-2]
J8  HDR_2X1  [HDR_2X1_100_S_T_10-8]
J11  HDR_2X1  [HDR_2X1_100_S_T_10-8]
J13  HDR_2X1  [HDR_2X1_100_S_T_10-8]
J19  HDR_2X1  [HDR_2X1_100_S_T_10-8]
J20  HDR_2X1  [HDR_2X1_100_S_T_10-8]
J22  HDR_2X1  [HDR_2X1_100_S_T_10-8]
R1  0E  [RES0402_0-5]
R10  10E_1%  [RES0402_0-5]
R11  10E_1%  [RES0402_0-5]
R12  0E  [RES0402_0-5]
R13  0E  [RES0402_0-5]
R22  0.01E_0.5%  [RES1206-4TERM_0-75]
R28  0E  [RES0402_0-5]
R43  0E  [RES0402_0-5]
R47  10K_1%  [RES0402N]
R48  0E  [RES0402_0-5]
R73  10E_1%  [RES0402_0-5]
R74  10E_1%  [RES0402_0-5]
R92  0.002E_1%  [RES2512-4TERM_0-75]
R122  0E  [RES0402_0-5]
R215  10E_1%  [RES0402_0-5]
R216  10E_1%  [RES0402_0-5]
R227  0.01E_0.5%  [RES1206-4TERM_0-75]
R228  10E_1%  [RES0402_0-5]
R229  10E_1%  [RES0402_0-5]
R233  0.01E_0.5%  [RES1206-4TERM_0-75]
R244  0E  [RES0402_0-5]
R265  4.7K  [RES0402_0-5]
R270  4.7K  [RES0402_0-5]
R280  10E_1%  [RES0402_0-5]
R281  10E_1%  [RES0402_0-5]
R295  0.01E_0.5%  [RES1206-4TERM_0-75]
R350  10E_1%  [RES0402_0-5]
R351  0.01E_0.5%  [RES1206-4TERM_0-75]
R352  10E_1%  [RES0402_0-5]
U1  INA226AIDGSR  [MSOP10_19-68_120X120_1-1]
U6  INA226AIDGSR  [MSOP10_19-68_120X120_1-1]
U11  INA226AIDGSR  [MSOP10_19-68_120X120_1-1]
U14  INA226AIDGSR  [MSOP10_19-68_120X120_1-1]
U16  INA226AIDGSR  [MSOP10_19-68_120X120_1-1]
U28  INA226AIDGSR  [MSOP10_19-68_120X120_1-1]

### Nets
DGND: C10.2 C17.2 C21.1 C31.1 C32.2 C45.2 C50.2 C55.1 C72.1 C109.2 C117.1 C221.1 J4.3 U1.7(GND) U6.1(A1) U6.7(GND) U11.7(GND) U14.1(A1) U14.2(A0) U14.7(GND) U16.2(A0) U16.7(GND) U28.7(GND)
SOC_DVDD1V8: J13.2 R233.3
SoC_DVDD3V3: J19.2 R295.1
VCC1V2_DDR: C21.2 J8.1 R22.1
VCC1V8: C221.2 J13.1 R233.2
VCC_3V3_SYS: C10.1 C17.1 C32.1 C45.1 C50.1 C55.2 C109.1 J19.1 R47.2 R265.1 R270.1 R295.4 U1.1(A1) U1.6(VS+) U6.2(A0) U6.6(VS+) U11.6(VS+) U14.6(VS+) U16.6(VS+) U28.6(VS+)
VCC_CORE: C72.2 J20.1 R92.3
VDD_0V85: C31.2 J11.1 R227.4
VDD_CORE: J20.2 R92.2
VDD_DDR4: J8.2 R22.4
VDDA1V8: C117.2 J22.1 R351.2
VDDA_1V8: J22.2 R351.3
VDDAR_CORE: J11.2 R227.1
INA_ALERT: J4.4 R1.2 R28.2 R43.2 R47.1 R48.2 R122.2 R244.2
SoC_I2C1_SCL: R13.1 R265.2 U1.5(SCL) U6.5(SCL) U11.2(A0) U11.5(SCL) U14.5(SCL) U16.1(A1) U16.5(SCL) U28.1(A1) U28.5(SCL) ; off-sheet SoC_I2C1_SCL
SoC_I2C1_SDA: R12.1 R270.2 U1.2(A0) U1.4(SDA) U6.4(SDA) U11.1(A1) U11.4(SDA) U14.4(SDA) U16.4(SDA) U28.2(A0) U28.4(SDA) ; off-sheet SoC_I2C1_SDA
NetC47_1: C47.1 R74.1 U14.10(VIN+)
NetC47_2: C47.2 R73.1 U14.8(VBUS) U14.9(VIN-)
NetC203_1: C203.1 R10.1 U1.10(VIN+)
NetC203_2: C203.2 R11.1 U1.8(VBUS) U1.9(VIN-)
NetC204_1: C204.1 R215.1 U6.10(VIN+)
NetC204_2: C204.2 R216.1 U6.8(VBUS) U6.9(VIN-)
NetC214_1: C214.1 R228.1 U11.10(VIN+)
NetC214_2: C214.2 R229.1 U11.8(VBUS) U11.9(VIN-)
NetC269_1: C269.1 R280.1 U16.10(VIN+)
NetC269_2: C269.2 R281.1 U16.8(VBUS) U16.9(VIN-)
NetC393_1: C393.1 R352.1 U28.10(VIN+)
NetC393_2: C393.2 R350.1 U28.8(VBUS) U28.9(VIN-)
NetJ4_1: J4.1 R13.2
NetJ4_2: J4.2 R12.2
NetR1_1: R1.1 U1.3(ALERT)
NetR10_2: R10.2 R22.2
NetR11_2: R11.2 R22.3
NetR28_1: R28.1 U6.3(ALERT)
NetR43_1: R43.1 U14.3(ALERT)
NetR48_1: R48.1 U16.3(ALERT)
NetR73_2: R73.2 R92.1
NetR74_2: R74.2 R92.4
NetR122_1: R122.1 U28.3(ALERT)
NetR215_2: R215.2 R227.3
NetR216_2: R216.2 R227.2
NetR228_2: R228.2 R233.1
NetR229_2: R229.2 R233.4
NetR244_1: R244.1 U11.3(ALERT)
NetR280_2: R280.2 R295.3
NetR281_2: R281.2 R295.2
NetR350_2: R350.2 R351.4
NetR351_1: R351.1 R352.2

Not connected (* = marked no-connect by the designer): J4 5*

### Notes on the sheet
- VDD_CORE
- D-Note :-
  Note the supply rail name change across the
  shunt when optimizing the design (Deleting
  the current sense)
- CURRENT MONITORING  DEVICES
- SoC_DVDD1V8
- CAD Note :-
  Follow Kelvin connection for
  Current Sensing when using 2
  terminal resistors
- (near R73) I2C ADDRESS: 0x40
- (near R229) I2C ADDRESS: 0x4B
- VDDAR_CORE
- VDDA_1V8
- (near R216) I2C ADDRESS: 0x41
- I2C ADDRESS: 0x4E
- SoC_DVDD3V3
- VDD_DDR4
- INA I2C SLAVE ADDRESS
- (near R281) I2C ADDRESS: 0x4C
- POWER SOURCE
- SUPPLY NET
- SLAVE
  ADDRESS
  (IN HEX)
- (near R11) I2C ADDRESS: 0x46
- VCC_CORE
- VDD_0V85
- 40
- 41
- VCC_3V3_SYS
- VCC1V8
- 4C
- 4B
- VDDA1V8
- VCC1V2_DDR
- 4E
- 46
- (in symbol MISTRAL_TITLEBLK_CSIZE) Title; Designed for TI by Mistral Solutions Pvt Ltd; Size; Rev; Date:; Sheet; of

### Library data of the parts
*#21 = MISTRAL_TITLEBLK_CSIZE: Issue: 1.0; Page Create Date: March  8, 1995; Page Modify Date: *
C10 C17 C21 C31 C55 C72 C117 C203 C204 C269 C393 = CAP_Dup3: as C67 on sheet 18; PCB Footprint: CAP0402_0-75; Footprint Path: Y:\MIS_DATABASE\Library\ALTIUM_TOOL\PCB_FOOTPRINTS\Altium_Footprint_Lib.PcbLib; Library Path: Y:\MIS_DATABASE\Library\ALTIUM_TOOL\SCHEMATICS_PARTS\MS_DISCRETE_Library.schlib; Footprint Ref: CAP0402_0-75; Library Ref: CAP; MECHANICAL 3D STEP FILE: CAP0402_0-75; Chkd/date: MANIRAJA/170820; Crtd /date: ALVY/170820; Datasheet: Y:\MIS_DATABASE\DATASHEETS\CAPACITORS\885012105018.PDF; Temperature: -55癈+85癈; Weight: 0.65mg; Height: 0.55MM; Distributor_part_number: 732-7495-1-ND; Distributor_name: DIGIKEY; Package: 0402; Tolerance: 20%
C32 C45 C47 C50 C109 C214 C221 = CAP_Dup3: as C89 on sheet 17; PCB Footprint: CAP0402_0-75; Tolerance: 20%; Package: 0402; Distributor_name: DIGIKEY; Distributor_part_number: 732-7495-1-ND; Height: 0.55MM; Weight: 0.65mg; Temperature: -55癈+85癈; Datasheet: Y:\MIS_DATABASE\DATASHEETS\CAPACITORS\885012105018.PDF; Crtd /date: ALVY/170820; Chkd/date: MANIRAJA/170820; MECHANICAL 3D STEP FILE: CAP0402_0-75; Library Ref: CAP; Footprint Ref: CAP0402_0-75; Library Path: Y:\MIS_DATABASE\Library\ALTIUM_TOOL\SCHEMATICS_PARTS\MS_DISCRETE_Library.schlib; Footprint Path: Y:\MIS_DATABASE\Library\ALTIUM_TOOL\PCB_FOOTPRINTS\Altium_Footprint_Lib.PcbLib
J4 = HEADER_5X1: CON HDR 1X5 2.54MM PITCH ST TH; Mistral Part No: 150009030262-R; Mfr_name: MOLEX; Part_type: CONNECTOR\HEADERS; Wattage: NA; Project: HSWD; Customs_HS_Code: 85369090; Custom_Duty: 24%; MECHANICAL 3D STEP FILE: HDR_5X1_100_S_T_11-2; Temperature: NA; Weight: 343mg; Voltage: NA; Tolerance: NA; Mfr_part_number: 22-03-2051; Package: THRU-HOLE; Distributor_name: DIGIKEY; Distributor_part_number: WM4003-ND; Height: 11.17MM; Datasheet: Y:\MIS_DATABASE\DATASHEETS\CONNECTORS\MOLEX022032021.PDF; Crtd /date: MAZHAR/280405; Chkd/date: VASANTHA/310117; Library Ref: HEADER_5X1; Library Path: Y:\MIS_DATABASE\Library\ALTIUM_TOOL\SCHEMATICS_PARTS\MS_CONNECTOR_Library.schlib; Footprint Path: Y:\MIS_DATABASE\Library\ALTIUM_TOOL\PCB_FOOTPRINTS\Altium_Footprint_Lib.PcbLib; PCB Footprint: HDR_5X1_100_S_T_11-2
J8 J11 J13 J19 J20 J22 = HEADER_2X1_Dup1: as J30 on sheet 20; Footprint Path: Y:\MIS_DATABASE\Library\ALTIUM_TOOL\PCB_FOOTPRINTS\Altium_Footprint_Lib.PcbLib; Library Path: Y:\MIS_DATABASE\Library\ALTIUM_TOOL\SCHEMATICS_PARTS\MS_Connector_Library.schlib; MECHANICAL 3D STEP FILE: HDR_2X1_100_S_T_10-8; Temperature: -0癈+75癈; Weight: 139gm; Voltage: NA; Tolerance: NA; Mfr_part_number: 22-03-2021; Package: THRU-HOLE; Distributor_name: DIGIKEY; Distributor_part_number: WM4000-ND; Height: 10.79MM; Datasheet: Y:\MIS_DATABASE\DATASHEETS\CONNECTORS\HEADER_X4030.PDF; Crtd /date: MAZHAR/280405; Chkd/date: VASANTHA/060117; Library Ref: HEADER_2X1; Footprint Ref: HDR_2X1_100_S_T_10-8; PCB Footprint: HDR_2X1_100_S_T_10-8
R1 R12 R28 R43 R244 = RESISTOR_Dup5: as R324 on sheet 17; Footprint Path: Y:\MIS_DATABASE\Library\ALTIUM_TOOL\PCB_FOOTPRINTS\Altium_Footprint_Lib.PcbLib; Library Path: Y:\MIS_DATABASE\Library\ALTIUM_TOOL\SCHEMATICS_PARTS\MS_DISCRETE_Library.schlib; Footprint Ref: RES0402_0-5; Library Ref: RESISTOR; Chkd/date: VASANTHA/201216; Crtd /date: MUDDU/190810; Datasheet: Y:\MIS_DATABASE\DATASHEETS\RESISTORS\CRCW0603.PDF; Temperature: -55癈+155癈; Weight: 0.65mg; Height: 0.40MM; Distributor_part_number: 541-0.0JCT-ND; Distributor_name: DIGIKEY; Package: 0402; Wattage: 1/16W; Tolerance: NA; MECHANICAL 3D STEP FILE: RES0402_0-5; PCB Footprint: RES0402_0-5
R10 R11 R73 R216 R281 R350 R352 = RESISTOR_Dup6: RES 10E 1/16W 1% 0402; Part_type: RESISTORS\FIXED; Mfr_part_number: RC0402FR-0710RL; Mfr_name: YAGEO AMERICA; Mistral Part No: 110018020004-R; Custom_Duty: 15%; Customs_HS_Code: 85332119; Voltage: NA; Project: TI_MAXIE_CPB; MECHANICAL 3D STEP FILE: RES0402_0-5; Chkd/date: MANIRAJA/070218; Crtd /date: ALVY/070218; Datasheet: Y:\MIS_DATABASE\DATASHEETS\RESISTORS\RCXXXXL-SER_MAR18.PDF; Temperature: -55癈+155癈; Weight: 0.65mg; Height: 0.40MM; Distributor_part_number: 311-10.0LRCT-ND; Distributor_name: DIGIKEY; Package: 0402; Wattage: 1/16W; Tolerance: 1%; Library Ref: RESISTOR; Footprint Ref: RES0402_0-5; Library Path: Y:\MIS_DATABASE\Library\ALTIUM_TOOL\SCHEMATICS_PARTS\MS_DISCRETE_Library.schlib; Footprint Path: Y:\MIS_DATABASE\Library\ALTIUM_TOOL\PCB_FOOTPRINTS\Altium_Footprint_Lib.PcbLib; PCB Footprint: RES0402_0-5
R13 R48 R122 = RESISTOR_Dup5: as R99 on sheet 18; MECHANICAL 3D STEP FILE: RES0402_0-5; Voltage: NA; Wattage: 1/16W; Package: 0402; Distributor_name: DIGIKEY; Distributor_part_number: 541-0.0JCT-ND; Height: 0.40MM; Weight: 0.65mg; Temperature: -55癈+155癈; Datasheet: Y:\MIS_DATABASE\DATASHEETS\RESISTORS\CRCW0603.PDF; Crtd /date: MUDDU/190810; Chkd/date: VASANTHA/201216; Library Ref: RESISTOR; Footprint Ref: RES0402_0-5; Library Path: Y:\MIS_DATABASE\Library\ALTIUM_TOOL\SCHEMATICS_PARTS\MS_DISCRETE_Library.schlib; Footprint Path: Y:\MIS_DATABASE\Library\ALTIUM_TOOL\PCB_FOOTPRINTS\Altium_Footprint_Lib.PcbLib; PCB Footprint: RES0402_0-5
R22 R233 R351 = RESISTOR-4TERM: RES 0.01E 1/2W 0.5% 1206-4; Part_type: RESISTORS\FIXED; Mfr_part_number: LVK12R010DER; Mfr_name: OHMITE; Mistral Part No: 110017090009-R; Custom_Duty: 15%; Customs_HS_Code: 85332119; Voltage: NA; Project: TI_MAXIE_CPB; PCB Footprint: RES1206-4TERM_0-75; Footprint Path: Y:\MIS_DATABASE\Library\ALTIUM_TOOL\PCB_FOOTPRINTS\Altium_Footprint_Lib.PcbLib; Library Path: Y:\MIS_DATABASE\Library\ALTIUM_TOOL\SCHEMATICS_PARTS\MS_DISCRETE_Library.schlib; Footprint Ref: RES1206-4TERM_0-75; Library Ref: RESISTOR-4TERM; MECHANICAL 3D STEP FILE: RES1206-4TERM_0-75; Chkd/date: MANIRAJA/260917; Crtd /date: MANIRAJA/260917; Datasheet: Y:\MIS_DATABASE\DATASHEETS\RESISTORS\LVK-SERIES.PDF; Temperature: -40癈+125癈; Weight: 16.2mg; Height: 0.65MM; Distributor_part_number: LVK12R010DERCT-ND; Distributor_name: DIGIKEY; Package: 1206-4; Wattage: 1/2W; Tolerance: 0.5%
R47 = RESISTOR_Dup3: RES 10K 1/16W 1% 0402; Part_type: RESISTORS\FIXED; Mfr_part_number: RC0402FR-0710KL; Mfr_name: YAGEO AMERICA; Mistral Part No: 110015090015-R; MECHANICAL 3D STEP FILE: RES0402_0-5; Voltage: NA; Custom_Duty: 15%; Customs_HS_Code: 85332119; Project: VOCERA; Footprint Path: Y:\MIS_DATABASE\Library\ALTIUM_TOOL\PCB_FOOTPRINTS\Altium_Footprint_Lib.PcbLib; Library Path: Y:\MIS_DATABASE\Library\ALTIUM_TOOL\SCHEMATICS_PARTS\MS_DISCRETE_Library.schlib; Footprint Ref: RES0402_0-5; Library Ref: RESISTOR; Temperature: -55癈+155癈; Weight: 0.65mg; Chkd/date: VASANTHA/201216; Crtd /date: GEETHA/290506; Datasheet: Y:\MIS_DATABASE\DATASHEETS\RESISTORS\RCXXXXL-SER_MAR18.PDF; Height: 0.40MM; Distributor_part_number: 311-10.0KLRTR-ND; Distributor_name: DIGIKEY; Package: 0402; Wattage: 1/16W; Tolerance: 1%; PCB Footprint: RES0402_0-5
R74 R215 R228 R229 R280 = RESISTOR_Dup6: RES 10E 1/16W 1% 0402; Mistral Part No: 110018020004-R; Mfr_name: YAGEO AMERICA; Mfr_part_number: RC0402FR-0710RL; Part_type: RESISTORS\FIXED; Project: TI_MAXIE_CPB; Voltage: NA; Customs_HS_Code: 85332119; Custom_Duty: 15%; Tolerance: 1%; Wattage: 1/16W; Package: 0402; Distributor_name: DIGIKEY; Distributor_part_number: 311-10.0LRCT-ND; Height: 0.40MM; Weight: 0.65mg; Temperature: -55癈+155癈; Datasheet: Y:\MIS_DATABASE\DATASHEETS\RESISTORS\RCXXXXL-SER_MAR18.PDF; Crtd /date: ALVY/070218; Chkd/date: MANIRAJA/070218; MECHANICAL 3D STEP FILE: RES0402_0-5; Library Ref: RESISTOR; Footprint Ref: RES0402_0-5; Library Path: Y:\MIS_DATABASE\Library\ALTIUM_TOOL\SCHEMATICS_PARTS\MS_DISCRETE_Library.schlib; Footprint Path: Y:\MIS_DATABASE\Library\ALTIUM_TOOL\PCB_FOOTPRINTS\Altium_Footprint_Lib.PcbLib; PCB Footprint: RES0402_0-5
R92 = RESISTOR-4TERM: RES 0.002E 2W 1% 2512-4; Mistral Part No: 110017090010-R; Mfr_name: OHMITE; Mfr_part_number: LVK25R002FER; Part_type: RESISTORS\FIXED; Project: TI_MAXIE_CPB; Voltage: NA; Customs_HS_Code: 85332119; Custom_Duty: 15%; PCB Footprint: RES2512-4TERM_0-75; Tolerance: 1%; Wattage: 2W; Package: 2512-4; Distributor_name: DIGIKEY; Distributor_part_number: LVK25R002FERCT-ND; Height: 0.70MM; Weight: NA; Temperature: -40癈+125癈; Datasheet: Y:\MIS_DATABASE\DATASHEETS\RESISTORS\LVK-SERIES.PDF; Crtd /date: MANIRAJA/260917; Chkd/date: MANIRAJA/260917; MECHANICAL 3D STEP FILE: RES2512-4TERM_0-75; Library Ref: RESISTOR-4TERM; Footprint Ref: RES2512-4TERM_0-75; Library Path: Y:\MIS_DATABASE\Library\ALTIUM_TOOL\SCHEMATICS_PARTS\MS_DISCRETE_Library.schlib; Footprint Path: Y:\MIS_DATABASE\Library\ALTIUM_TOOL\PCB_FOOTPRINTS\Altium_Footprint_Lib.PcbLib
R227 R295 = RESISTOR-4TERM: RES 0.01E 1/2W 0.5% 1206-4; Mistral Part No: 110017090009-R; Mfr_name: OHMITE; Mfr_part_number: LVK12R010DER; Part_type: RESISTORS\FIXED; Project: TI_MAXIE_CPB; Voltage: NA; Customs_HS_Code: 85332119; Custom_Duty: 15%; PCB Footprint: RES1206-4TERM_0-75; Library Ref: RESISTOR-4TERM; Tolerance: 0.5%; Wattage: 1/2W; Package: 1206-4; Distributor_name: DIGIKEY; Distributor_part_number: LVK12R010DERCT-ND; Height: 0.65MM; Weight: 16.2mg; Temperature: -40癈+125癈; Datasheet: Y:\MIS_DATABASE\DATASHEETS\RESISTORS\LVK-SERIES.PDF; Crtd /date: MANIRAJA/260917; Chkd/date: MANIRAJA/260917; MECHANICAL 3D STEP FILE: RES1206-4TERM_0-75; Footprint Ref: RES1206-4TERM_0-75; Library Path: Y:\MIS_DATABASE\Library\ALTIUM_TOOL\SCHEMATICS_PARTS\MS_DISCRETE_Library.schlib; Footprint Path: Y:\MIS_DATABASE\Library\ALTIUM_TOOL\PCB_FOOTPRINTS\Altium_Footprint_Lib.PcbLib
R265 = RESISTOR_Dup4: RES 4.7K 1/16W 5% 0402; Mistral Part No: 110011060001-R; Mfr_name: YAGEO AMERICA; Mfr_part_number: RC0402JR-074K7L; Part_type: RESISTORS\FIXED; Project: TMDXCSK368; Voltage: NA; Customs_HS_Code: 85332119; Custom_Duty: 15%; PCB Footprint: RES0402_0-5; Library Ref: RESISTOR; Tolerance: 5%; Wattage: 1/16W; Package: 0402; Distributor_name: DIGIKEY; Distributor_part_number: 311-4.7KJRCT-ND; Height: 0.40MM; Weight: 0.65mg; Temperature: -55癈+155癈; Datasheet: Y:\MIS_DATABASE\DATASHEETS\RESISTORS\RCXXXXL-SER_MAR18.PDF; Crtd /date: VASANTHA/130516; Chkd/date: VASANTHA/130516; Footprint Ref: RES0402_0-5; MECHANICAL 3D STEP FILE: RES0402_0-5; Library Path: Y:\MIS_DATABASE\Library\ALTIUM_TOOL\SCHEMATICS_PARTS\MS_DISCRETE_Library.schlib; Footprint Path: Y:\MIS_DATABASE\Library\ALTIUM_TOOL\PCB_FOOTPRINTS\Altium_Footprint_Lib.PcbLib
R270 = RESISTOR_Dup4: RES 4.7K 1/16W 5% 0402; Part_type: RESISTORS\FIXED; Mfr_part_number: RC0402JR-074K7L; Mfr_name: YAGEO AMERICA; Mistral Part No: 110011060001-R; Custom_Duty: 15%; Customs_HS_Code: 85332119; Voltage: NA; Project: TMDXCSK368; PCB Footprint: RES0402_0-5; Footprint Path: Y:\MIS_DATABASE\Library\ALTIUM_TOOL\PCB_FOOTPRINTS\Altium_Footprint_Lib.PcbLib; Library Path: Y:\MIS_DATABASE\Library\ALTIUM_TOOL\SCHEMATICS_PARTS\MS_DISCRETE_Library.schlib; MECHANICAL 3D STEP FILE: RES0402_0-5; Footprint Ref: RES0402_0-5; Chkd/date: VASANTHA/130516; Crtd /date: VASANTHA/130516; Datasheet: Y:\MIS_DATABASE\DATASHEETS\RESISTORS\RCXXXXL-SER_MAR18.PDF; Temperature: -55癈+155癈; Weight: 0.65mg; Height: 0.40MM; Distributor_part_number: 311-4.7KJRCT-ND; Distributor_name: DIGIKEY; Package: 0402; Wattage: 1/16W; Tolerance: 5%; Library Ref: RESISTOR
U1 U6 U11 U14 U16 U28 = INA226AIDGS_MSOP10: IC BI-DIRECTIONAL CURRENT MONITER MSOP10; Mistral Part No: 141011080019-R; Mfr_name: TEXAS INSTRUMENTS; Part_type: ICS\INTERFACE; Project: DM385EVM_BASE-BOARD; Tolerance: NA; Customs_HS_Code: 85423100; Custom_Duty: 15%; Chkd/date: MANIRAJA/050417; Mfr_part_number: INA226AIDGSR; Voltage: NA; Wattage: NA; Package: MSOP10; Distributor_name: DIGIKEY; Distributor_part_number: 296-29034-1-ND; Height: 1.10MM; Weight: NA; Temperature: -40癈+125癈; Datasheet: Y:\MIS_DATABASE\DATASHEETS\ICS\INTERFACE\INA226.PDF; Crtd /date: MANIRAJA/050417; MECHANICAL 3D STEP FILE: MSOP10_19-68_120X120_1-1; Library Ref: INA226AIDGS_MSOP10; Footprint Ref: MSOP10_19-68_120X120_1-1; Library Path: Y:\MIS_DATABASE\Library\ALTIUM_TOOL\SCHEMATICS_PARTS\MS_MISCINTERFACE_Library.schlib; Footprint Path: Y:\MIS_DATABASE\Library\ALTIUM_TOOL\PCB_FOOTPRINTS\Altium_Footprint_Lib.PcbLib; PCB Footprint: MSOP10_19-68_120X120_1-1